# Altium project DevBoard.PrjPcb
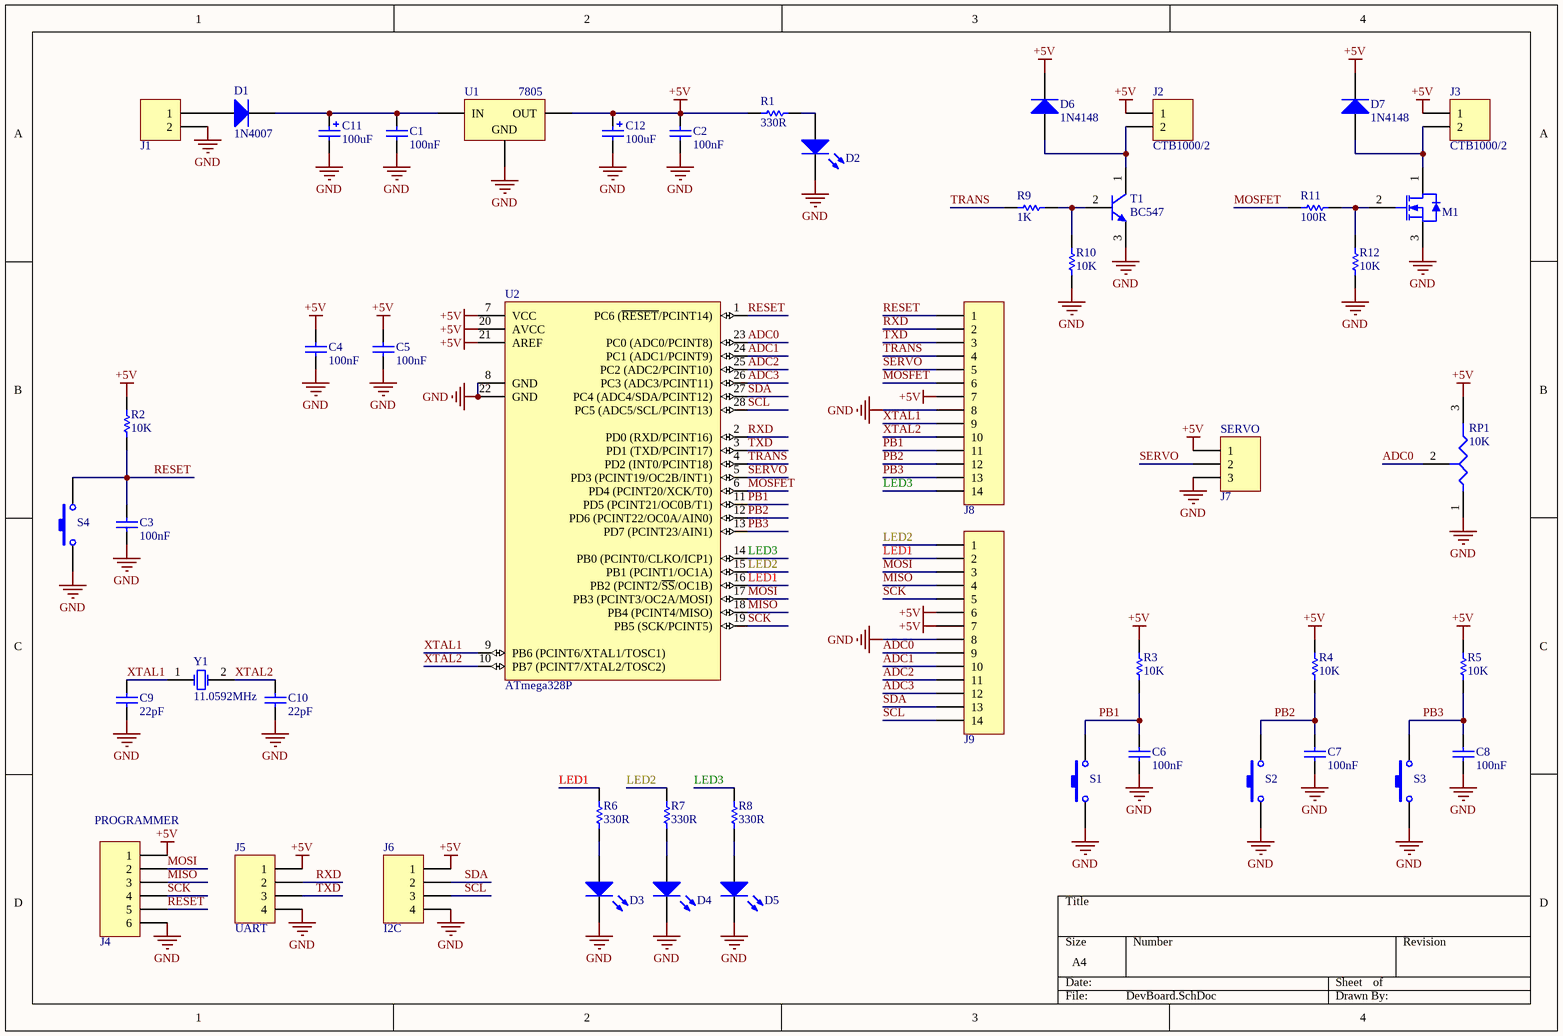
[diagram p0: DevBoard.SchDoc]
1 sheet, 50 parts. Net scope: global (net labels, ports and power ports of the same name join across sheets).
Board file: DevBoard.PcbDoc

## Sheet DevBoard.SchDoc
size A4

### Parts
C1  100nF  [RAD-0.1]
C2  100nF  [RAD-0.1]
C3  100nF  [RAD-0.1]
C4  100nF  [RAD-0.1]
C5  100nF  [RAD-0.1]
C6  100nF  [RAD-0.1]
C7  100nF  [RAD-0.1]
C8  100nF  [RAD-0.1]
C9  22pF  [RAD-0.1]
C10  22pF  [RAD-0.1]
C11  100uF  [CAP3.5mmX8mm]
C12  100uF  [CAP3.5mmX8mm]
D1  1N4007  [DO-41]
D2  Power ON  [LED3mmRED]  (value not drawn)
D3  LED1  [LED3mmRED]  (value not drawn)
D4  LED1  [LED3MMYELLOW]  (value not drawn)
D5  LED1  [LED3MMGREEN]  (value not drawn)
D6  1N4148  [DO-35]
D7  1N4148  [DO-35]
J1  CTB1000/2  [CTB1000/2]  (value not drawn)
J2  CTB1000/2  [CTB1000/2]
J3  CTB1000/2  [CTB1000/2]
J4  PROGRAMMER  [HEADER1X6]
J5  UART  [HEADER1X4]
J6  I2C  [HEADER1X4]
J7  SERVO  [HEADER1X3]
J8  HEADER1X14  [HEADER1X14]  (value not drawn)
J9  HEADER1X14  [HEADER1X14]  (value not drawn)
M1  BS170  [TO-92]  (value not drawn)
R1  330R  [AXIAL-0.3]
R2  10K  [AXIAL-0.3]
R3  10K  [AXIAL-0.3]
R4  10K  [AXIAL-0.3]
R5  10K  [AXIAL-0.3]
R6  330R  [AXIAL-0.3]
R7  330R  [AXIAL-0.3]
R8  330R  [AXIAL-0.3]
R9  1K  [AXIAL-0.3]
R10  10K  [AXIAL-0.3]
R11  100R  [AXIAL-0.3]
R12  10K  [AXIAL-0.3]
RP1  10K  [HPOT]
S1  SW-PB  [MICROPUSHBUTTON]  (value not drawn)
S2  SW-PB  [MICROPUSHBUTTON]  (value not drawn)
S3  SW-PB  [MICROPUSHBUTTON]  (value not drawn)
S4  SW-PB  [MICROPUSHBUTTON]  (value not drawn)
T1  BC547  [TO-92]
U1  7805  [TO-220L]
U2  ATmega328P  [28P3]
Y1  11.0592MHz  [TH HC-49S]

### Nets
+5V: C2.2 C4.2 C5.2 C12.1 D6.2(K) D7.2(K) J2.1 J3.1 J4.1 J5.1 J6.1 J7.1 J8.7 J9.6 J9.7 R1.1 R2.2 R3.2 R4.2 R5.2 RP1.3 U1.3(OUT) U2.7(VCC) U2.20(AVCC) U2.21(AREF)
GND: C1.1 C2.1 C3.1 C4.1 C5.1 C6.1 C7.1 C8.1 C9.1 C10.1 C11.2 C12.2 D2.2(K) D3.2(K) D4.2(K) D5.2(K) J1.2 J4.6 J5.4 J6.4 J7.3 J8.8 J9.8 M1.3(S) R10.2 R12.1 RP1.1 S1.1 S2.1 S3.1 S4.1 T1.3(E) U1.2(GND) U2.8(GND) U2.22(GND)
ADC0: J9.9 RP1.2 U2.23(PC0_(ADC0/PCINT8))
ADC1: J9.10 U2.24(PC1_(ADC1/PCINT9))
ADC2: J9.11 U2.25(PC2_(ADC2/PCINT10))
ADC3: J9.12 U2.26(PC3_(ADC3/PCINT11))
LED1: J9.2 R6.2 U2.16(PB2_(PCINT2/~{SS}/OC1B))
LED2: J9.1 R7.2 U2.15(PB1_(PCINT1/OC1A))
LED3: J8.14 R8.2 U2.14(PB0_(PCINT0/CLKO/ICP1))
MISO: J4.3 J9.4 U2.18(PB4_(PCINT4/MISO))
MOSFET: J8.6 R11.1 U2.6(PD4_(PCINT20/XCK/T0))
MOSI: J4.2 J9.3 U2.17(PB3_(PCINT3/OC2A/MOSI))
PB1: C6.2 J8.11 R3.1 S1.2 U2.11(PD5_(PCINT21/OC0B/T1))
PB2: C7.2 J8.12 R4.1 S2.2 U2.12(PD6_(PCINT22/OC0A/AIN0))
PB3: C8.2 J8.13 R5.1 S3.2 U2.13(PD7_(PCINT23/AIN1))
RESET: C3.2 J4.5 J8.1 R2.1 S4.2 U2.1(PC6_(~{RESET}/PCINT14))
RXD: J5.2 J8.2 U2.2(PD0_(RXD/PCINT16))
SCK: J4.4 J9.5 U2.19(PB5_(SCK/PCINT5))
SCL: J6.3 J9.14 U2.28(PC5_(ADC5/SCL/PCINT13))
SDA: J6.2 J9.13 U2.27(PC4_(ADC4/SDA/PCINT12))
SERVO: J7.2 J8.5 U2.5(PD3_(PCINT19/OC2B/INT1))
TRANS: J8.4 R9.2 U2.4(PD2_(INT0/PCINT18))
TXD: J5.3 J8.3 U2.3(PD1_(TXD/PCINT17))
XTAL1: C9.2 J8.9 U2.9(PB6_(PCINT6/XTAL1/TOSC1)) Y1.1(OSC1)
XTAL2: C10.2 J8.10 U2.10(PB7_(PCINT7/XTAL2/TOSC2)) Y1.2(OSC2)
NetC1_2: C1.2 C11.1 D1.2(K) U1.1(IN)
NetD1_1: D1.1(A) J1.1
NetD2_1: D2.1(A) R1.2
NetD3_1: D3.1(A) R6.1
NetD4_1: D4.1(A) R7.1
NetD5_1: D5.1(A) R8.1
NetD6_1: D6.1(A) J2.2 T1.1(C)
NetD7_1: D7.1(A) J3.2 M1.1(D)
NetM1_2: M1.2(G) R11.2 R12.2
NetR9_1: R9.1 R10.1 T1.2(B)

### Library data of the parts
C1-C10 = CAP: Ceramic Capacitor
  C1-C8: Value: 100nF
  C9 C10: Value: 22pF
C11 C12 = CAP POL: Electrolytic Capacitor; Voltage Rating: 35V; Value: 100uF
D1 = 1N4007: Rectifier, 1A, 1000V
D2-D5 = LED
D6 D7 = 1N4148: High Conductance Fast Diode
J1-J3 = CTB1000/2: CTB1000/2, PCB TERMINAL BLOCK, 5MM, 2WAY; Manufacturer: CAMDENBOSS; Implementation: Yes; Ordering code: CN19745; Value: clamp  2pin; Datasheet: http://www.farnell.com/datasheets/1870880.pdf; Distributor: Farnell; Manufacturer code: CTB1000/2
J4 = HEADER1X6: Header, 6-Pin, 1-row
J5 J6 = HEADER1X4: Header, 4-Pin, 1-row
J7 = HEADER1X3: Header, 3-Pin, 1-row
J8 J9 = HEADER1X14: Header, 14-pin, 1-row
M1 = BS170: N-Channel MOSFET
R1-R12 = Resistor: Power Rating: 1/4W
  R1 R6-R8: Value: 330R
  R2-R5 R10 R12: Value: 10K
  R9: Value: 1K
  R11: Value: 100R
RP1 = POT: Potentiometer; Value: 10K
S1-S4 = SW-PB: Pushbutton
T1 = BC547: NPN Epitaxial Silicon Transistor
U1 = LM7805: Positive Voltage Regulator, 5V, 1A, TO-220
U2 = ATmega328P: 8-bit Atmel Microcontroller with 32KB In-System Programmable Flash
Y1 = Crystal Quartz: Resonator: quartz; Value: 11.0592MHz